# EAGLE design sensorCR123Orig (EAGLE 6.6.0)
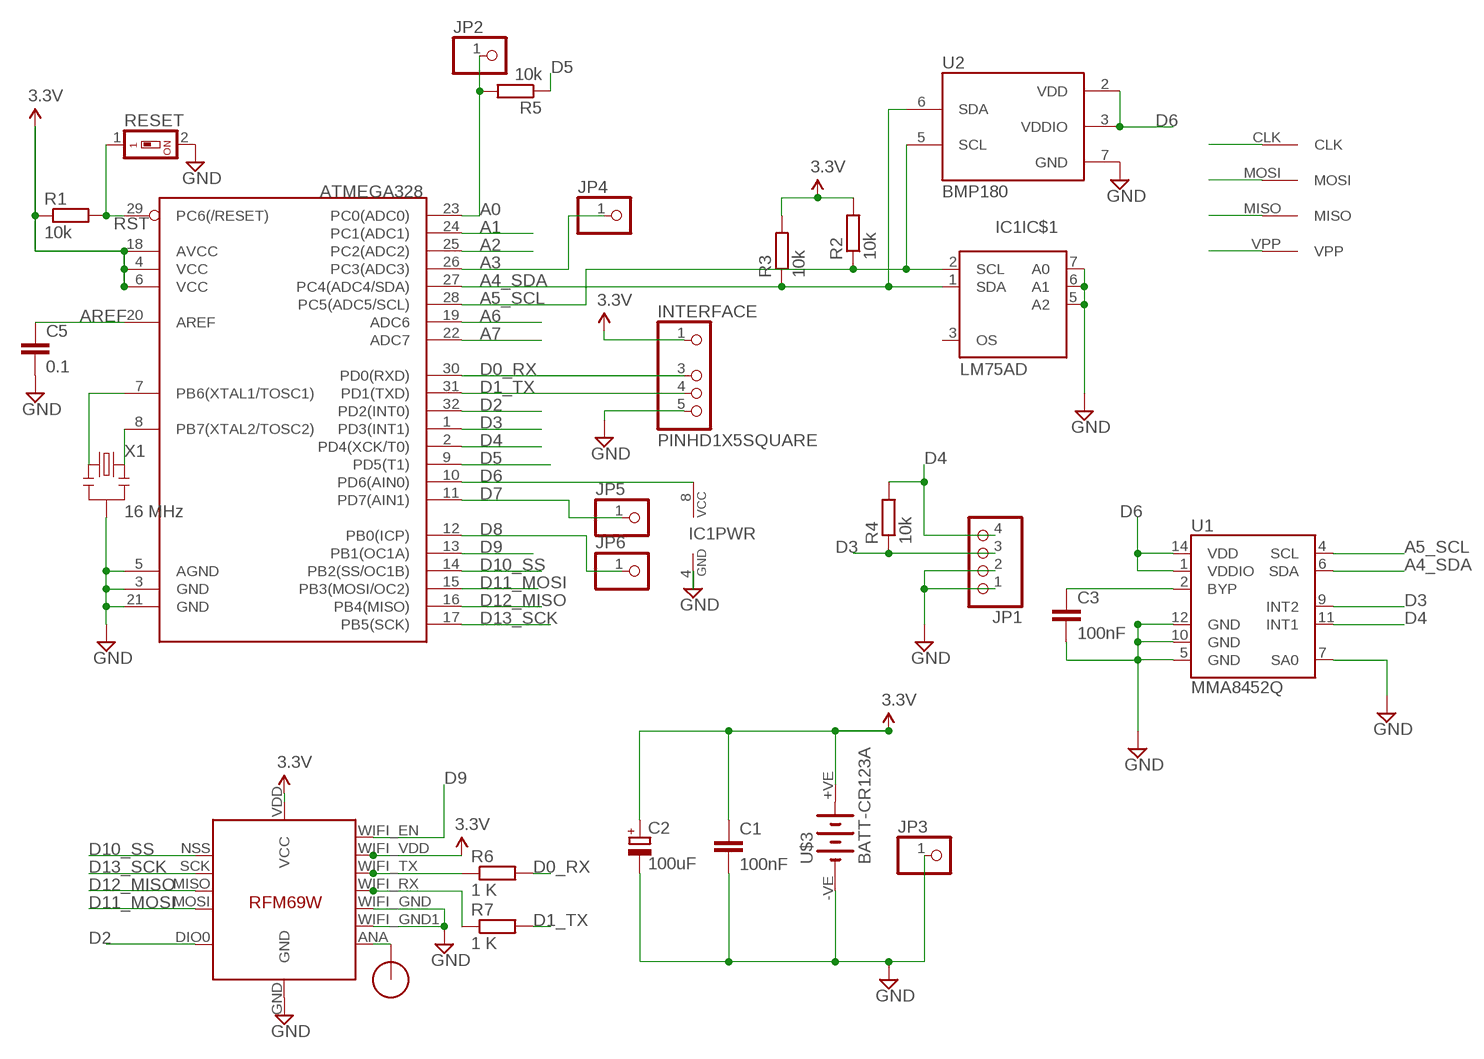
[diagram p0: schematic, sheet 1]

## Parts
ATMEGA328  ATMega-328  ATMEGA168/328TQFP32  [TQFP32-08]
C1  100nF  C-EUC2012  [C2012]
C2  100uF  CPOL-EUSMCB  [SMC_B]
C3  100nF  C-EUC2012  [C2012]
C5  0.1  C-EUC2012  [C2012]
IC1  LM75AD  [SO08]
IC4  RFM69-ESP03  [RFM69W-ESP03]
INTERFACE  PINHD1X5SQUARE  [PINHD1X05-SQUARE]
JP1  PINHD-1X04_2.54-S  [1X04-S]
JP2  PINHD-1X01_2.54  [1X01]
JP3  PINHD-1X01_2.54  [1X01]
JP4  PINHD-1X01_2.54  [1X01]
JP5  PINHD-1X01_2.54  [1X01]
JP6  PINHD-1X01_2.54  [1X01]
R1  10k  R-EU_R2012  [R2012]
R2  10k  R-EU_R2012  [R2012]
R3  10k  R-EU_R2012  [R2012]
R4  10k  R-EU_R2012  [R2012]
R5  10k  R-EU_R2012  [R2012]
R6  1 K  R-EU_M2012  [M2012]
R7  1 K  R-EU_M2012  [M2012]
RESET  SWS001  [SMS-001]
U1  MMA8452Q  [QFN-16_0.5MM]
U2  BMP180  [BMP180]
U$1  RFM12B_ANTENNA  [RFM12B-ANTENNA]
U$2  AVRHEADERDIP  [AVRHEADER]
U$3  BATT-CR123A  [KEYSTONE-2/3A]
X1  16 MHz  RESONATORSMD  [RESONATOR-SMD]

## Nets
A0: ATMEGA328.23(PC0(ADC0)) JP2.1 R5.2
A1: ATMEGA328.24(PC1(ADC1))
A2: ATMEGA328.25(PC2(ADC2))
A3: ATMEGA328.26(PC3(ADC3)) JP4.1
A4_SDA: ATMEGA328.27(PC4(ADC4/SDA)) IC1.1(IC$1:SDA) R3.1 U1.6(SDA) U2.6(SDA)
A5_SCL: ATMEGA328.28(PC5(ADC5/SCL)) IC1.2(IC$1:SCL) R2.1 U1.4(SCL) U2.5(SCL)
A6: ATMEGA328.19(ADC6)
A7: ATMEGA328.22(ADC7)
AREF: ATMEGA328.20(AREF) C5.1
D0_RX: ATMEGA328.30(PD0(RXD)) INTERFACE.3 R6.2
D1_TX: ATMEGA328.31(PD1(TXD)) INTERFACE.4 R7.2
D2: ATMEGA328.32(PD2(INT0)) IC4.DIO0
D3: ATMEGA328.1(PD3(INT1)) JP1.3 R4.1 U1.9(INT2)
D4: ATMEGA328.2(PD4(XCK/T0)) JP1.4 R4.2 U1.11(INT1)
D5: ATMEGA328.9(PD5(T1)) R5.1
D6: ATMEGA328.10(PD6(AIN0)) IC1.8(PWR:VCC) U1.1(VDDIO) U1.14(VDD) U2.2(VDD) U2.3(VDDIO)
D7: ATMEGA328.11(PD7(AIN1)) JP5.1
D8: ATMEGA328.12(PB0(ICP)) JP6.1
D9: ATMEGA328.13(PB1(OC1A)) IC4.WIFI_EN
D10_SS: ATMEGA328.14(PB2(SS/OC1B)) IC4.NSS(SEL)
D11_MOSI: ATMEGA328.15(PB3(MOSI/OC2)) IC4.MOSI U$2.MOSI
D12_MISO: ATMEGA328.16(PB4(MISO)) IC4.MISO U$2.MISO
D13_SCK: ATMEGA328.17(PB5(SCK)) IC4.SCK U$2.CLK
GND: ATMEGA328.3(GND) ATMEGA328.5(AGND) ATMEGA328.21(GND) C1.2 C2.- C3.2 C5.2 IC1.4(PWR:GND) IC1.5(IC$1:A2) IC1.6(IC$1:A1) IC1.7(IC$1:A0) IC4.GND IC4.WIFI_GND IC4.WIFI_GND1 INTERFACE.5 JP1.1 JP1.2 JP3.1 RESET.2 U1.5(GND) U1.7(SA0) U1.10(GND) U1.12(GND) U2.7(GND) U$3.-VE(-) X1.2
N$1: ATMEGA328.7(PB6(XTAL1/TOSC1)) X1.1
N$2: C3.1 U1.2(BYP)
N$3: IC4.ANA(ANT) U$1.P$1
N$10: IC4.WIFI_TX R6.1
N$11: IC4.WIFI_RX R7.1
N$21: ATMEGA328.8(PB7(XTAL2/TOSC2)) X1.3
RST: ATMEGA328.29(PC6(/RESET)) R1.2 RESET.1 U$2.VPP
VCC: ATMEGA328.4(VCC) ATMEGA328.6(VCC) ATMEGA328.18(AVCC) C1.1 C2.+ IC4.VDD(VCC) IC4.WIFI_VDD INTERFACE.1 R1.1 R2.2 R3.2 U$3.+VE(+) ; supply symbol labelled 3.3V
Unconnected: IC1.3(IC$1:OS)

## Library data of the parts
ATMEGA328 = LowPowerLab:ATMEGA168/328: Atmel 32-pin 8-bit micro, 16k flash.
C1 C3 C5 = resistor:C-EU: CAPACITOR, European symbol
C2 = resistor:CPOL-EU: POLARIZED CAPACITOR, European symbol
IC1 = i2c:LM75AD: Digital Temperature Sensor and Thermal Watchdog
IC4 = RemoteHome:RFM69-ESP03
INTERFACE = eagle-library-edeca.net-v5:PINHD1X5
JP1 = pinhead-2:PINHD-1X04: PIN HEADER
JP2-JP6 = pinhead-2:PINHD-1X01: PIN HEADER
R1-R7 = resistor:R-EU_: RESISTOR, European symbol
RESET = smd-special:SWS001: SMD Dip Switch 1 pol.
U1 = SparkFun-Sensors:MMA8452Q: MMA8452Q 3-Axis, 12/8-bit Digital Accelerometer Supply Voltage: 1.6-3.6V Range: +/- 2g, 4g, 8g Interface: I2C, 12-bit and 8-bit ODR: 1.56 Hz - 800 Hz Package: QFN-16 http://cache.freescale.com/files/sensors/doc/data_sheet/MMA8452Q.pdf; PROD_ID: IC-10769
U2 = SparkFun-Sensors:BMP180: BOSCH BMP180 DIGITAL BAROMETRIC PRESSURE SENSOR Web page: http://www.bosch-sensortec.com/en/homepage/products_3/environmental_sensors_1/bmp180_1/bmp180 Datasheet: http://ae-bst.resource.bosch.com/media/products/dokumente/bmp180/BST-BMP180-DS000-09.pdf The BMP180 is the function compatible successor of the BMP085, a new generation of high precision digital pressure sensors for consumer applications. The ultra-low power, low voltage electronics of the BMP180 is optimized for use in mobile phones, PDAs, GPS navigation devices and outdoor equipment. With a low altitude noise of merely 0.25m at fast conversion time, the BMP180 offers superior performance. The I2C interface allows for easy system integration with a microcontroller. The BMP180 is based on piezo-resistive technology for EMC robustness, high accuracy and linearity as well as long term stability. Key features: - Temperature measurement included - I2C interface - Fully calibrated - Pb-free, halogen-free and RoHS compliant, - MSL 1 Basic specs: Pressure range: 300 to 1100hPa (+9000m to -500m relating to sea level) Supply voltage: 1.8 to 3.6V (VDD), 1.62V to 3.6V (VDDIO) Package: LGA package with metal lid Small footprint: 3.6mm x 3.8mm Super-flat: 0.93mm height Low power: 5μA at 1 sample / sec. in standard mode Low noise: 0.06hPa (0.5m) in ultra low power mode, 0.02hPa (0.17m) advanced resolution mode Typical applications: - Enhancement of GPS navigation (dead-reckoning, slope detection, etc.) - In- and out-door navigation - Leisure and sports - Weather forecast - Vertical velocity indication (rise/sink speed)
U$1 = LowPowerLab:RFM12B_ANTENNA
U$2 = RemoteHome:AVRHEADER
U$3 = eagle-library-edeca.net-v5:BATT-CR123A: CR123A (2/3rd AA) battery holder Manufacturer: Keystone Mouser part: 534-1019
X1 = SparkFun:RESONATOR: Resonator Small SMD resonator. This is the itty bitty 10/20MHz resonators with built in caps. CSTCE10M0G55 and CSTCE20M0V53. Footprint has been reviewed closely but hasn't been tested yet.

## Net classes
1 power: width 0.381 mm, clearance 0.254 mm

## Board
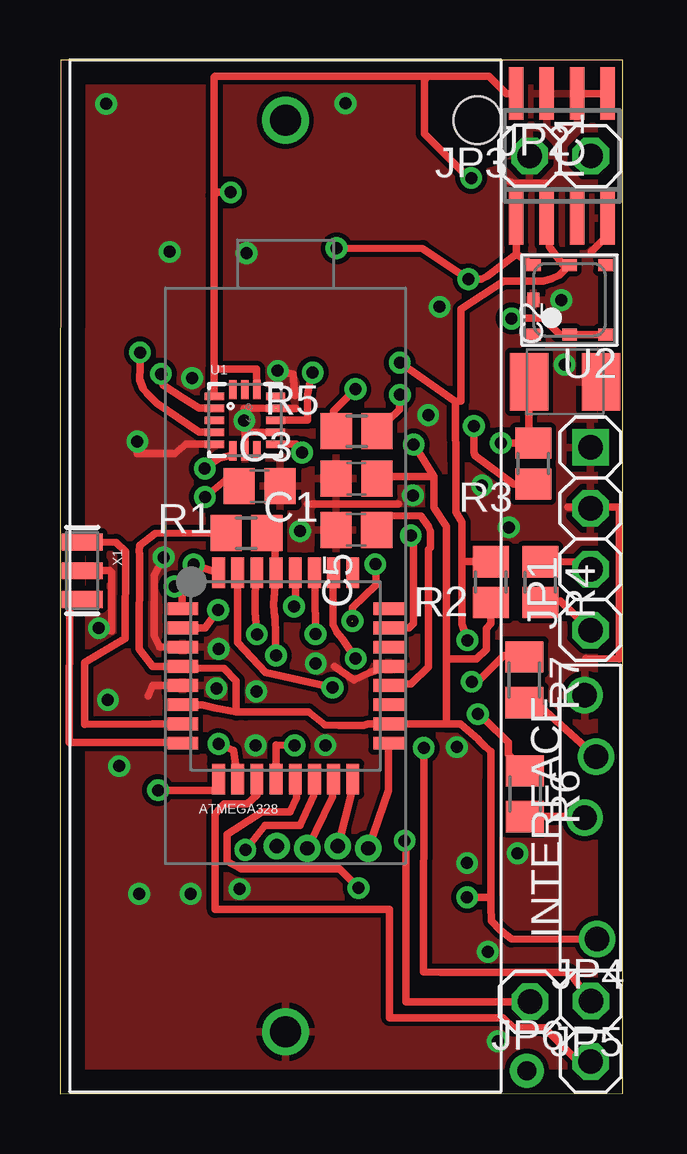
[diagram p1: board, top side]
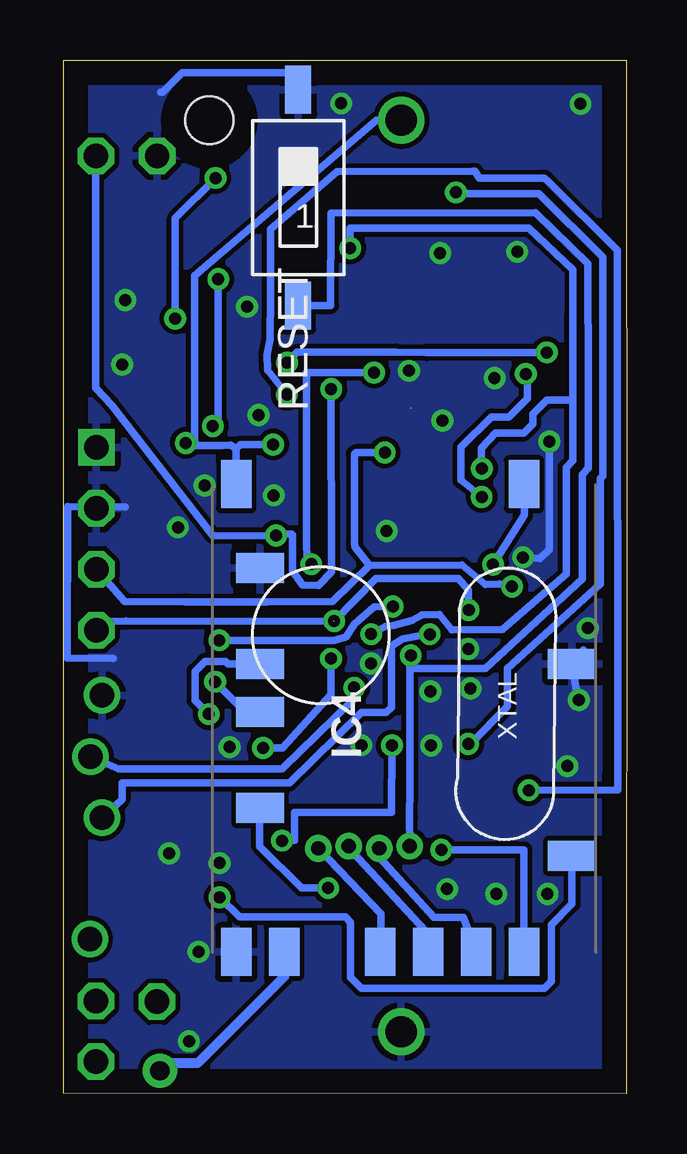
[diagram p2: board, bottom side, seen from below]

Size 23.48 x 43.09 mm. Coordinates in mm from the lower left corner, seen from the top.
Outline: 0.02,0 23.48,0.01 23.47,43.09 0.02,43.09 0.02,37.02 0,26.83 0.02,0
Copper layers (1*16): Top 0.035mm / dielectric 1.5mm / Bottom 0.035mm
Design rules "default": minimum track width 10mil, minimum drill 24mil, track to track 8mil, track to pad 8mil, pad to pad 8mil, via to via 8mil, smd to smd 8mil, copper to edge 40mil, drill to drill 8mil, minimum pad ring 10mil, minimum via ring 8mil, stop-mask expansion 4mil, vias tented up to drill 0mil, thermal gap 10mil

### Footprints (pad centres in the part's own frame; a part is rotated, then mirrored left to right if it is on the bottom)
TQFP32-08 = smd 1.27 x 0.533: 1 -4.293,2.8; 2 -4.293,2; 3 -4.293,1.2; 4 -4.293,0.4; 5 -4.293,-0.4; 6 -4.293,-1.2; 7 -4.293,-2; 8 -4.293,-2.8; 17 4.293,-2.8; 18 4.293,-2; 19 4.293,-1.2; 20 4.293,-0.4; 21 4.293,0.4; 22 4.293,1.2; 23 4.293,2; 24 4.293,2.8 | smd 0.533 x 1.27: 9 -2.8,-4.293; 10 -2,-4.293; 11 -1.2,-4.293; 12 -0.4,-4.293; 13 0.4,-4.293; 14 1.2,-4.293; 15 2,-4.293; 16 2.8,-4.293; 25 2.8,4.293; 26 2,4.293; 27 1.2,4.293; 28 0.4,4.293; 29 -0.4,4.293; 30 -1.2,4.293; 31 -2,4.293; 32 -2.8,4.293
C2012 = smd 1.3 x 1.5: 1 -0.85,0; 2 0.85,0
SMC_B = smd 1.6 x 2.4: + -1.5,0; - 1.5,0
SO08 = smd 0.6 x 2.2: 1 -1.905,-2.6; 2 -0.635,-2.6; 3 0.635,-2.6; 4 1.905,-2.6; 5 1.905,2.6; 6 0.635,2.6; 7 -0.635,2.6; 8 -1.905,2.6
RFM69W-ESP03 = smd 2 x 1.27: ANA 8,-5; DIO0 -11.5,5; GND 8,-7; MISO 8,1; MOSI 8,3; NSS 8,5; SCK 8,-1; VDD -11.5,-7 | smd 1.27 x 2: WIFI_EN 2,-6; WIFI_GND -8,-6; WIFI_GND1 -4,7; WIFI_RX -2,-6; WIFI_TX -4,-6; WIFI_VDD 4,7
PINHD1X05-SQUARE = drill 1.016: 1 -5.061,-0.269; 3 0,0.24; 4 2.54,-0.24; 5 5.099,0.24
1X04-S = drill 1.016 square: 1 -3.81,0 | drill 1.016 octagon: 2 -1.27,0; 3 1.27,0; 4 3.81,0
1X01 = drill 1.016 octagon: 1 0,0
R2012 = smd 1.3 x 1.5: 1 -0.85,0; 2 0.85,0
M2012 = smd 1.3 x 1.6: 1 -0.95,0; 2 0.95,0
SMS-001 = smd 1.092 x 2.007: 1 0,-4.496; 2 0,4.496
QFN-16_0.5MM = smd 0.8 x 0.3: 1 -1.275,1; 2 -1.275,0.5; 3 -1.275,0; 4 -1.275,-0.5; 5 -1.275,-1; 9 1.275,-1; 10 1.275,-0.5; 11 1.275,0; 12 1.275,0.5; 13 1.275,1 | smd 0.3 x 0.8: 6 -0.5,-1.275; 7 0,-1.275; 8 0.5,-1.275; 14 0.5,1.275; 15 0,1.275; 16 -0.5,1.275
BMP180 = smd 0.6 x 0.5: 1 1.5,1.45; 2 0,1.45; 3 -1.5,1.45; 4 -1.5,-1.45; 5 0,-1.45; 6 1.5,-1.45 | smd 0.5 x 0.6: 7 1.5,0
RFM12B-ANTENNA = drill 0.8 pad 1.422: P$1 0,0
AVRHEADER = drill 0.6 pad 0.813: CLK 2.54,0; MISO 1.27,0.091; MOSI 0,0; VPP -1.27,0.099
KEYSTONE-2/3A = drill 1.3: +VE 0,19; -VE 0,-19 | hole 2: 8,19
RESONATOR-SMD = smd 0.7 x 1.7: 1 -1.2,0; 2 0,0; 3 1.2,0

### Placement (x,y rotation side)
ATMEGA328  9.41,17.41 0 top
C1  12.37,25.63 180 top
C2  21.06,29.67 0 top
C3  8.32,25.32 0 top
C5  12.36,23.5 180 top
IC1  20.93,39.09 0 top
IC4  9.29,13.91 270 bottom
INTERFACE  22.12,11.5 90 top
JP1  22.12,23.13 270 top
JP2  22.14,39.08 0 top
JP3  19.58,39.09 0 top
JP4  22.14,3.85 0 top
JP5  22.13,1.33 0 top
JP6  19.6,3.84 0 top
R1  7.77,23.37 0 top
R2  17.96,21.33 270 top
R3  19.73,26.26 90 top
R4  20.03,21.32 270 top
R5  12.37,27.62 180 top
R6  19.39,12.5 270 top
R7  19.36,17.25 270 top
RESET  13.7,37.35 0 bottom
U1  7.71,28.07 0 top
U2  21.25,33.09 180 top
U$1  19.47,0.95 0 top
U$2  10.32,10.22 0 top
U$3  9.4,21.58 0 top
X1  0.93,21.8 270 top

### Tracks (layer width: path | path; a pad name or v marks a point on that pad's centre or on a via)
A0  (via drill 0.5)
  Top 0.305: v14.63,23.26 14.73,23.12 14.73,19.59 14.55,19.41 ATMEGA328.23 | R5.2 11.4,28.44 v12.32,29.37 | ATMEGA328.23
  Bottom 0.305: JP2.1 22.14,29.41 21.47,28.69 17.24,23.25 v14.63,23.26 14.69,23.33 13.97,23.33 13.93,23.29 13.93,21.8 13.51,21.21 12.85,21.19 12.31,21.74 v12.32,29.37
A3  (via drill 0.5)
  Top 0.305: ATMEGA328.26 11.38,21.7 11.38,19.56 11.55,19.22 11.77,18.94 v12.33,18.13 | v15.17,14.41 15.17,5.07 15.86,5.07 21.24,5.07 JP4.1
  Bottom 0.305: v12.33,18.13 12.34,16.64 14.36,14.4 v15.17,14.41
A4_SDA  (via drill 0.5)
  Top 0.305: ATMEGA328.27 10.64,20.98 v10.66,19.15 | U1.6 7.21,26.62 6.65,26.5 6.22,26.21 6.06,26.06 v6.04,26.06 | IC1.1 19.03,35 | 19.03,35 U2.6 | R3.1 18.92,25.41 17.31,26.61 17.26,26.74 v17.26,27.83 | 19.03,35 17.82,34.07 17.58,33.95 v17.03,33.95 15.12,35.23 v11.53,35.24
  Bottom 0.305: v10.66,19.15 10.05,19.48 9.73,19.51 8.96,19.73 8.54,19.95 7.81,19.96 7.29,19.34 5.19,19.35 2.51,21.66 2.52,26.1 2.24,26.39 2.24,28.8 | 2.24,28.8 2.24,32.51 2.24,34.35 4.08,36.07 5.49,36.07 11.54,36.08 11.54,35.27 v11.53,35.24 | v6.04,26.06 6.05,26.91 5.47,27.54 4.3,27.54 3.92,27.92 3.92,28.32 3.33,28.91 2.35,28.91 2.24,28.8 | v17.03,33.95 17.03,28.12 v17.26,27.83
A5_SCL  (via drill 0.5)
  Top 0.305: ATMEGA328.28 9.83,20.6 v9.76,20.3 | 16.5,28.85 16.49,27.97 16.5,26.41 16.5,24.25 16.76,23.82 16.76,22.23 | 16.5,28.85 v14.17,30.47 | U1.4 5.8,27.58 4.03,28.79 3.64,29.18 3.48,29.38 3.33,29.77 3.34,30.28 v3.33,30.9 | IC1.2 20.29,36.48 20.42,35.31 20.96,34.55 U2.5 20.82,34.11 20.51,33.98 20.16,33.86 18.51,33.86 16.73,32.7 16.73,32.43 16.72,32.28 16.72,28.88 16.6,28.86 16.5,28.85 | 16.76,22.23 16.76,19.59 v16.99,18.9 | R2.1 16.81,22.18 16.76,22.23
  Bottom 0.305: v14.17,30.47 14.05,30.61 13.74,30.91 9.64,30.92 8.36,30.9 8.28,30.9 5.67,30.9 v3.33,30.9 | v9.76,20.3 10.55,20.3 11.36,19.58 11.7,19.04 12.21,18.88 13.98,18.89 14.9,18.89 16.47,18.89 16.89,18.89 v16.99,18.9
AREF
  Top 0.305: C5.1 13.48,24.1 15.05,24.09 15.36,23.64 15.44,23.44 15.44,22.77 15.35,22.68 15.35,17.79 14.63,17.07 13.76,17.07 ATMEGA328.20
D0_RX  (via drill 0.5)
  Top 0.305: v8.21,19.15 8.15,19.84 8.14,20.07 8.15,21.89 ATMEGA328.30 | R6.2 21.57,11.55 INTERFACE.3
  Bottom 0.305: v8.21,19.15 8.38,19.15 9.35,18.96 9.81,18.67 9.81,16.1 10.04,15.88 11.06,15.89 14.07,12.94 21.05,12.95 21.05,12.28 INTERFACE.3
D1_TX  (via drill 0.5)
  Top 0.305: v11.36,16.92 8.57,17.55 7.41,18.81 7.4,21.41 ATMEGA328.31 | R7.2 19.82,16.32 INTERFACE.4
  Bottom 0.305: v11.36,16.92 11.42,16.41 14.37,13.54 21.18,13.54 INTERFACE.4
D2  (via drill 0.5)
  Top 0.305: v5.57,22.06 5.86,21.95 ATMEGA328.32
  Bottom 0.305: IC4.DIO0 4.29,25.38 4.24,25.33 4.26,24.12 v5.57,22.06
D3  (via drill 0.5)
  Top 0.305: ATMEGA328.1 5.09,20.76 v4.78,21.15 | U1.9 9.85,27.08 v10.09,26.73 | R4.1 21.68,22.17 JP1.3
  Bottom 0.305: JP1.3 20.93,20.51 18.42,20.5 15,20.5 12.26,20.52 10.72,22.02 | 10.72,22.02 6.86,22.04 5.88,21.23 5.31,21.25 v4.78,21.15 | v10.09,26.73 11.29,26.72 11.35,26.67 11.36,22.93 11.34,22.78 10.72,22.02
D4  (via drill 0.5)  (1 unrouted)
  Top 0.305: ATMEGA328.2 6.04,19.41 v6.59,20.16 | U1.11 10.33,28.07 10.33,29.13 10.49,29.97 v10.54,30.06 | R4.2 20.86,20.54 JP1.4 | v13.15,22.07 13.18,21.2 12.21,20.27 12.19,20.04 v12.2,19.7
  Bottom 0.305: v6.59,20.16 6.61,21 7.02,21.48 10.45,21.48 12.21,19.68 20.88,19.69 21.74,19.69 JP1.4 | v10.54,30.06 13.35,30.06 13.35,27.11 13.35,23.17 13.33,22.1 v13.15,22.07
D5  (via drill 0.5)
  Top 0.305: R5.1 14.16,28.52 v14.17,29.13 | v4.09,12.65 6.6,12.64 ATMEGA328.9
  Bottom 0.305: v14.17,29.13 14.97,30.16 14.99,30.8 14.86,31.43 14.86,33.31 14.86,36.04 12.08,38.44 6.42,38.44 6.32,38.44 6.15,38.17 3.43,38.17 3.28,38.02 0.39,35.17 0.38,12.66 v4.09,12.65
D6  (via drill 0.5)
  Top 0.305: U1.1 6.43,30.21 | 6.43,30.21 8.2,30.2 U1.14 | IC1.8 18.6,41.69 17.89,42.41 15.35,42.41 | 15.35,42.41 6.47,42.41 6.43,42.37 6.43,37.44 | 6.43,37.44 6.43,30.21 | U2.3 U2.2 20.82,31.65 20.14,32.33 18.85,32.33 v18.83,32.31 | v17.15,38.17 17.05,38.17 15.19,40.02 15.19,42.25 15.35,42.41 | ATMEGA328.10 7.23,14.32 v6.61,14.57 | v7.12,37.57 6.55,37.57 6.43,37.44
  Bottom 0.305: v18.83,32.31 18.83,36.49 v17.15,38.17 | v6.61,14.57 6.52,14.59 4.97,16.13 4.97,17.73 1.1,21.24 1.1,25.65 1,25.75 1,34.86 3.66,37.52 7.28,37.52 v7.12,37.57
D7
  Top 0.305: JP5.1 21.61,1.33 20.2,2.74 18.9,2.74 18.47,3.17 13.74,3.17 13.74,7.67 6.47,7.67 6.47,11.66 6.84,12.07 7.79,12.07 8.21,12.44 ATMEGA328.11
D8  (via drill 0.5)
  Top 0.305: ATMEGA328.12 9,14.53 v9.79,14.51 | v14.37,10.54 14.44,10.54 14.44,3.84 JP6.1
  Bottom 0.305: v9.79,14.51 9.81,11.73 13.84,11.73 13.84,10.56 14.37,10.56 v14.37,10.54
D9  (via drill 0.5)
  Top 0.305: ATMEGA328.13 9.86,13.12 9.86,12.33 9.6,11.75 8.42,11.75 6.97,10.81 6.97,9.68 7.54,9.37 11.65,9.37 v12.45,8.57
  Bottom 0.305: v12.45,8.57 13.56,8.57 15.3,10.31 15.3,11.9 IC4.WIFI_EN
D10_SS  (via drill 0.5)
  Top 0.305: v7.73,10.16 8.55,11.17 10,11.18 10.57,12.42 ATMEGA328.14
  Bottom 0.305: IC4.NSS 4.28,10.16 v7.73,10.16
D11_MOSI
  Top 0.305: ATMEGA328.15 11.36,12.38 U$2.MOSI
  Bottom 0.305: IC4.MOSI 6.81,7.34 8.04,7.34 10.32,9.87 U$2.MOSI
D12_MISO
  Top 0.305: ATMEGA328.16 12.17,12.6 U$2.MISO
  Bottom 0.305: IC4.MISO 8.29,6.76 8.39,6.79 11.44,10.09 U$2.MISO
D13_SCK
  Top 0.305: ATMEGA328.17 13.71,12.65 U$2.CLK
  Bottom 0.305: IC4.SCK 10.29,6.3 10.26,6.79 10.25,7.5 U$2.CLK
GND  (via drill 0.5)  (1 unrouted)
  Top 0.305: ATMEGA328.5 3.86,17.01 3.68,16.58 | ATMEGA328.3 4.17,18.61 3.92,19.11 3.92,21.61 v4.32,22.36 | U1.7 7.72,27.56 | 7.72,27.56 v7.69,28.05 7.68,28.57 U1.12 | U1.10 7.72,27.56 | X1.2 2.08,21.8 2.16,21.72 2.16,19.71 2.16,19.63 2.16,19.29 v1.62,19.4 | v3.23,27.18 3.22,26.67 4.78,26.67 5.26,27.08 5.55,27.07 U1.5 | 9.56,25.06 9.45,25.59 C3.2 | v9.08,30.14 9.16,30.12 9.71,30 9.8,29.1 | 9.02,28.56 9.84,28.56 | IC1.6 IC1.5 | IC1.4 22.84,35.79 22.15,35.1 | 14.12,24.58 10.33,24.58 | 18.48,38.14 18.92,37.95 20.26,37.95 | 21.93,18.13 23.32,18.12 23.32,24.45 21.17,24.45 | 11.44,17.8 12.26,17.24 12.92,17.56 ATMEGA328.21
  Bottom 0.305: v4.32,22.36 3.62,22.31 3.22,22.68 3.22,26.76 v3.23,27.18 | 1.81,18.49 IC4.WIFI_GND1 2.13,16.96 v2,16.41 | 19.43,41.75 19.35,41.75 18.54,42.56 14.13,42.56 13.7,42.12 | 13.7,42.12 13.63,42.06 | RESET.2 13.7,42.12 | 20.92,24.45 23.3,24.48 23.33,18.16 21.42,18.14
  other vias: 18.72,23.61 6.61,18.53 6.52,16.89 8.19,16.77 10.66,17.94 11.07,14.52 17.85,5.91 19.08,10.02 5.51,29.83 4.57,35.09 7.78,35.04 20.91,33.08 10.01,23.45 15.83,32.8 14.72,24.94 21.04,30.39 15.36,28.28 17.6,25.34 8.16,14.52 5.44,8.33 3.3,8.33 16.98,9.61 16.56,14.44 2.47,13.65 1.93,41.26 11.91,41.28 18.26,2.18 7.49,8.53
  pour Top: 0.22,0.15 0.19,42.84 23.26,42.89 23.28,0.19
  pour Bottom: 0.2,42.85 23.25,42.89 23.29,0.19 0.21,0.16
N$1
  Top 0.305: X1.1 2.33,22.98 2.73,22.59 2.72,18.98 1.03,17.97 1.03,15.4 3.87,15.4 4.46,15.4 ATMEGA328.7
N$2  (via drill 0.5)
  Top 0.305: C3.1 6.91,25.57 v6.04,24.87 | v4.21,30 4.31,29.53 5.14,28.99 5.79,28.58 U1.2
  Bottom 0.305: v6.04,24.87 6.92,25.57 6.91,26.04 6.91,26.95 5.63,28.21 4.91,28.21 4.15,28.96 4.15,29.9 v4.21,30
N$3
  Bottom 0.406: IC4.ANA 14.29,4.88 17.89,1.27 19.2,1.27 U$1.P$1
N$10  (via drill 0.5)
  Top 0.305: v17.43,15.82 17.73,15.6 18.69,14.64 18.71,14.13 R6.1
  Bottom 0.305: IC4.WIFI_TX 16.62,17.91 16.72,18.02 17.58,18.02 18,17.6 18,16.4 v17.43,15.82
N$11  (via drill 0.5)
  Top 0.305: v17.17,17.17 17.41,17.17 18.51,18.26 19.6,18.26 R7.1
  Bottom 0.305: IC4.WIFI_RX 15.91,15.91 v17.17,17.17
N$21
  Top 0.305: X1.3 0.4,20.58 0.4,18.46 0.39,17.3 0.39,14.65 4.76,14.63 ATMEGA328.8
RST  (via drill 0.5)
  Top 0.305: v9.01,18.26 8.96,19.89 8.94,19.87 8.91,20.39 ATMEGA328.29 9,21.98 8.95,23.34 8.95,23.43 R1.2
  Bottom 0.305: 9.04,17.72 9.05,12.7 9.05,11.54 U$2.VPP | 9.04,17.72 v9.01,18.26 | RESET.1 12.35,32.85 12.33,36.7 3.8,36.72 1.63,34.59 1.6,29.54 1.61,29.1 1.61,26.07 1.86,25.82 1.86,21.44 5.9,17.72 9.04,17.72
VCC  (via drill 0.5)
  Top 0.305: ATMEGA328.6 5.95,16.2 6.44,16.07 7.34,15.91 | 7.34,15.91 7.74,15.9 8.58,15.92 10.36,15.92 11.04,15.37 11.63,15.36 12.3,15.36 12.66,15.35 12.85,15.41 12.94,15.41 ATMEGA328.18 14.11,15.41 15.4,15.41 16.12,15.41 | 7.34,15.91 7.34,17.21 7.33,17.21 6.85,17.72 5.22,17.75 ATMEGA328.4 4.59,17.8 3.86,17.8 3.31,18.53 3.32,22.49 3.3,22.6 3.33,22.85 3.97,23.36 R1.1 | INTERFACE.1 18.82,6.45 18.35,6.83 18,7.2 17.98,7.81 17.98,8.15 | 17.98,8.15 17.98,13.11 17.98,14.26 17.73,14.47 17.5,14.71 17.44,14.76 16.7,15.41 16.12,15.41 | 16.11,18.13 16.12,23.64 15.6,24.44 15.6,25.73 | 16.11,18.13 16.11,16.76 16.11,15.99 16.12,15.41 | C2.+ 19.56,27.21 R3.2 18.65,27.11 v18.38,27.12 | 15.6,25.73 13.7,25.73 C1.1 | 15.6,25.73 14.96,26.77 v14.75,27.06 | R2.2 17.96,19.59 17.78,19.4 17.78,18.52 17.36,18.12 16.13,18.12 16.11,18.13 | v16.97,8.19 17.92,8.19 17.98,8.15
  Bottom 0.305: 18.02,27.02 18.02,31.66 18.02,34.09 10.43,40.59 9.38,40.59 U$3.+VE | 18.02,27.02 16.87,27.02 16.51,27.04 16.29,26.88 | 16.56,25.41 IC4.VDD 16.29,26.88 | v18.38,27.12 18,27.13 18.02,27.02 | v14.75,27.06 16.11,27.06 16.29,26.88 | IC4.WIFI_VDD 2.29,7.9 3.14,7.05 3.14,4.69 3.44,4.39 11.07,4.39 11.53,4.85 11.53,7.15 11.74,7.36 16.15,7.36 v16.97,8.19